# EAGLE design beer (EAGLE 6.2)
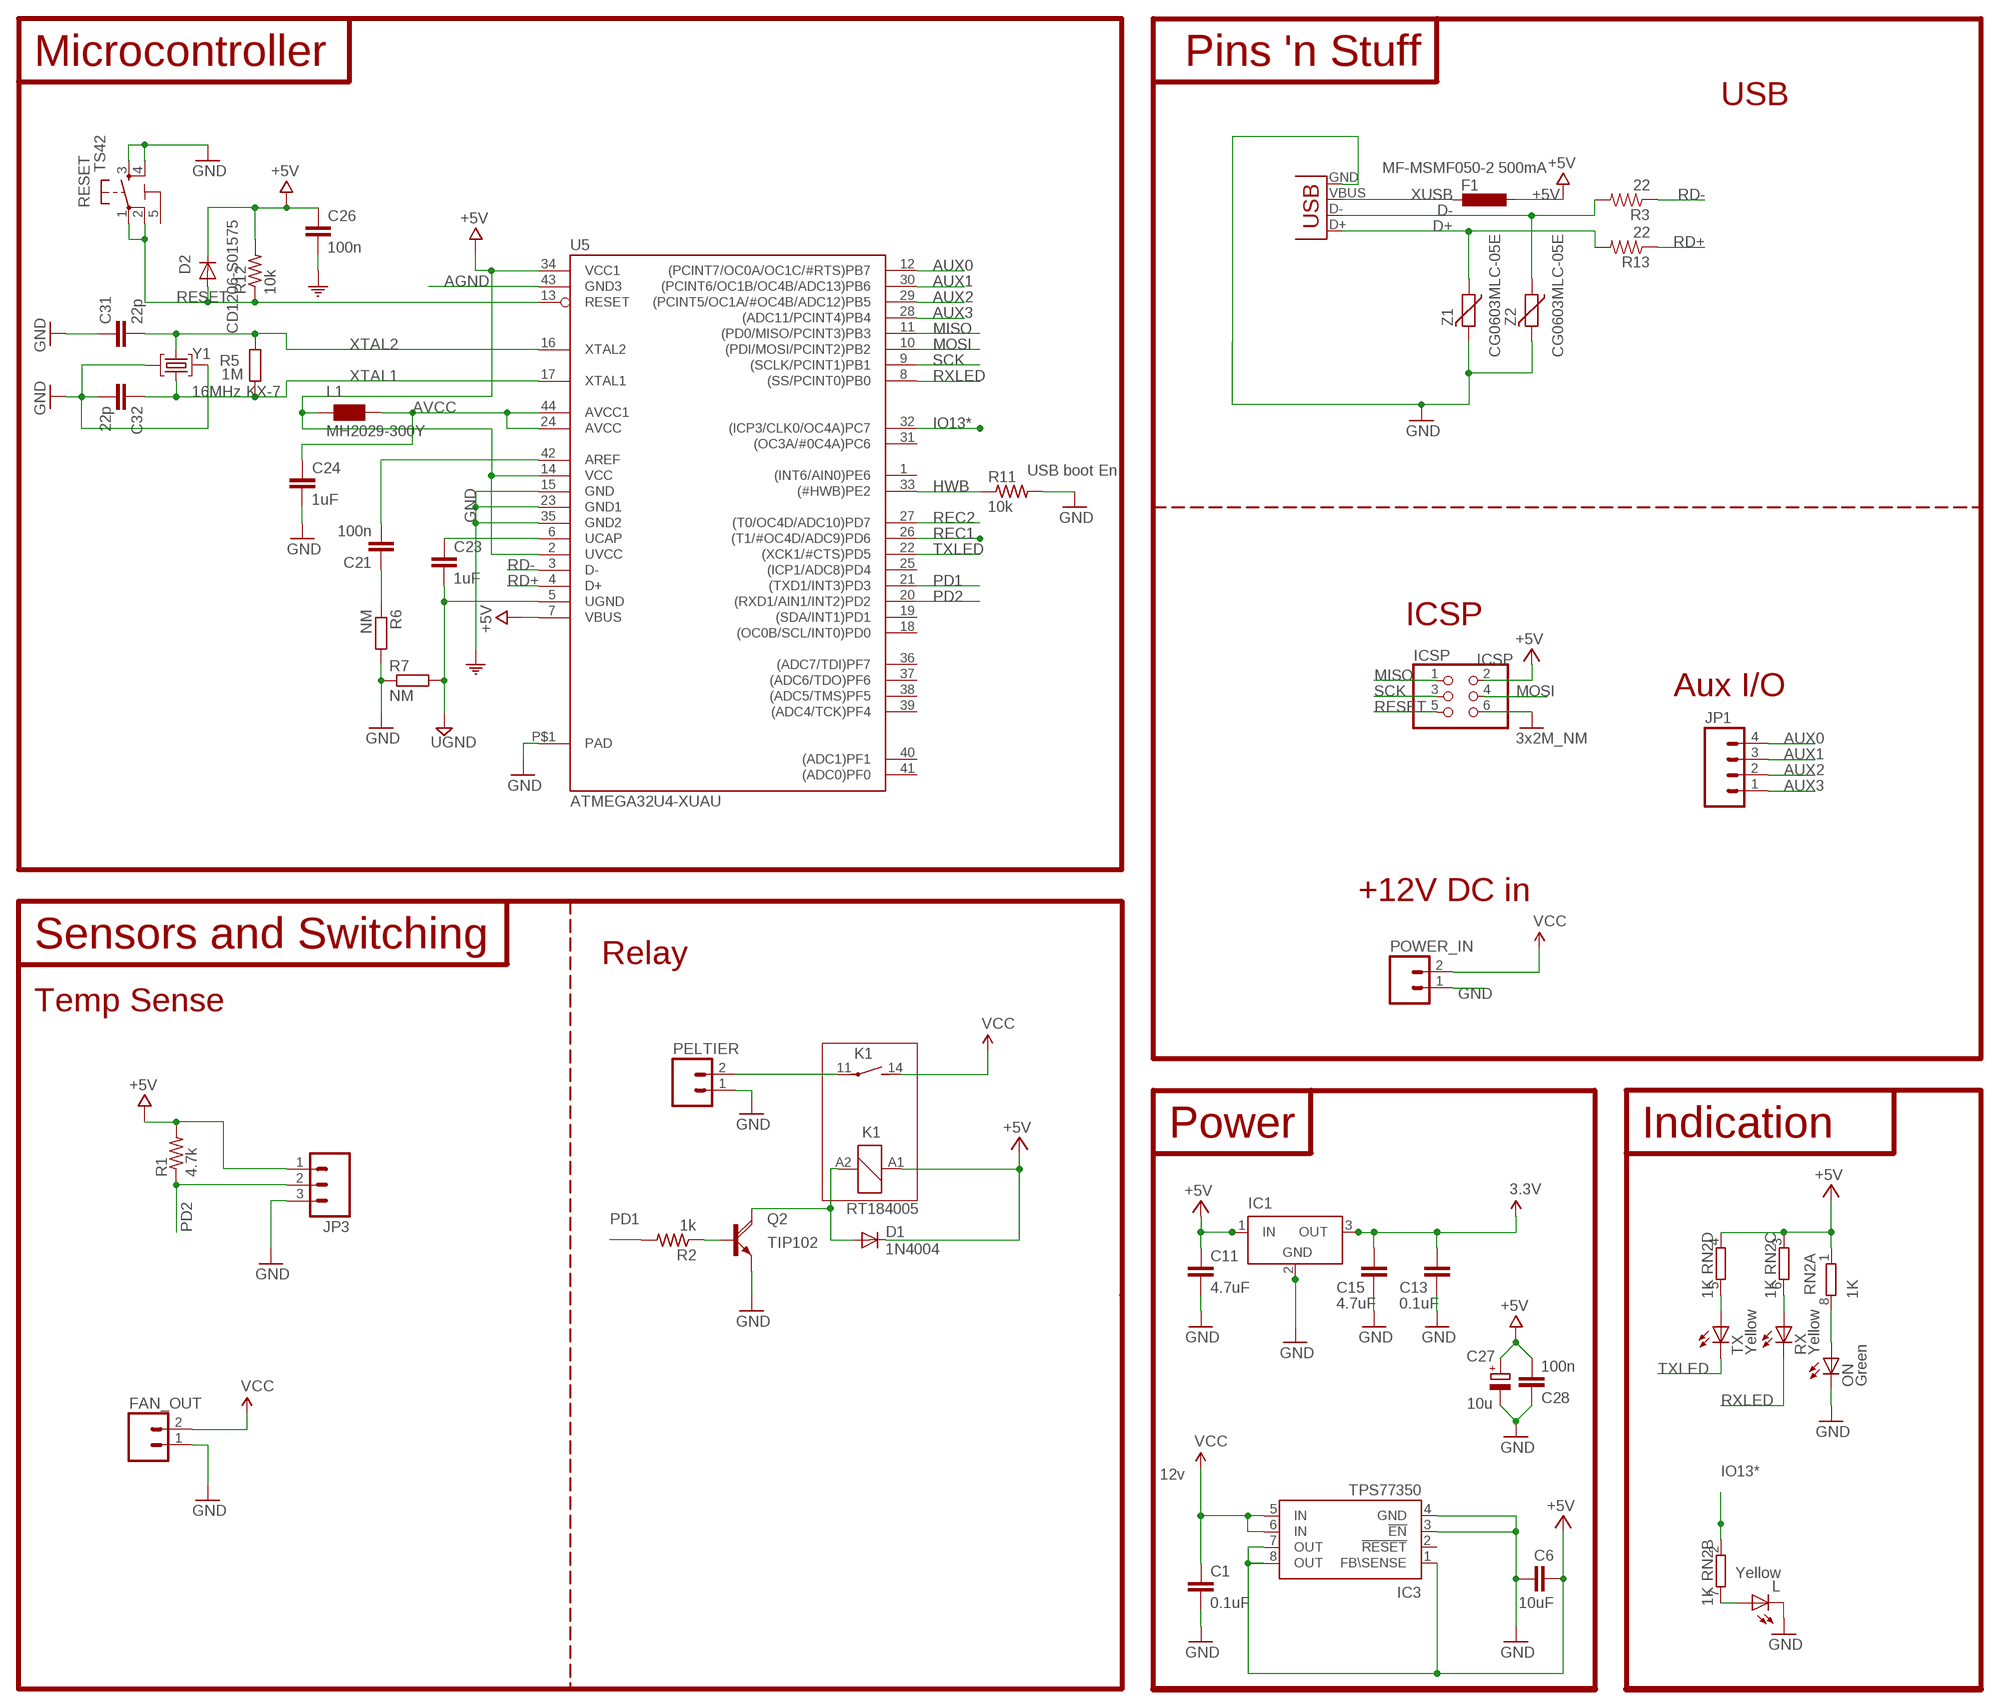
[diagram p0: schematic, sheet 1]

## Parts
C1  0.1uF  CAP0402-CAP  [0402-CAP]
C6  10uF  CAP0402-CAP  [0402-CAP]
C11  4.7uF  CAP0402-CAP  [0402-CAP]
C13  0.1uF  CAP0402-CAP  [0402-CAP]
C15  4.7uF  CAP0402-CAP  [0402-CAP]
C21  100n  C-EUC0603  [C0603-ROUND]
C23  1uF  C-EUC0603  [C0603-ROUND]
C24  1uF  C-EUC0603  [C0603-ROUND]
C26  100n  C-EUC0603  [C0603-ROUND]
C27  10u  CPOL-EUSMCB  [SMC_B]
C28  100n  C-EUC0603  [C0603-ROUND]
C31  22p  C-EUC0603  [C0603-ROUND]
C32  22p  C-EUC0603  [C0603-ROUND]
D1  1N4004  [DO41-10]
D2  CD1206-S01575  DIODE-MINIMELF  [MINIMELF]
F1  MF-MSMF050-2 500mA  L-EUL1812  [L1812]
FAN_OUT  M02PTH  [1X02]
IC1  LT1129CST5  [SOT223]
IC3  TPS77350  [SOP-08]
ICSP  ICSP  PINHD-2X3  [2X03]
JP1  M04PTH  [1X04]
JP3  M03PTH  [1X03]
K1  RT184005  [RT-N/O12A3.5]
L  Yellow  LEDCHIPLED_0805  [CHIPLED_0805]
L1  MH2029-300Y  WE-CBF_0805  [0805]
ON  Green  LEDCHIPLED_0805  [CHIPLED_0805]
PELTIER  M02PTH  [1X02]
POWER_IN  M02PTH  [1X02]
Q2  TIP120  [TO220AH]
R1  4.7k  R-US_R0603  [R0603]
R2  1k  R-US_R0603  [R0603]
R3  22  RESISTOR0603-RES  [0603-RES]
R5  1M  R-EU_R0603  [R0603-ROUND]
R6  NM  R-EU_R0603  [R0603-ROUND]
R7  NM  R-EU_R0603  [R0603-ROUND]
R11  10k  R-US_R0603  [R0603]
R12  10k  R-US_R0603  [R0603]
R13  22  RESISTOR0603-RES  [0603-RES]
RESET  TS42  [TS42]
RN2  1K  4R-NCAY16  [CAY16]
RX  Yellow  LEDCHIPLED_0805  [CHIPLED_0805]
TX  Yellow  LEDCHIPLED_0805  [CHIPLED_0805]
U5  ATMEGA32U4-XUAU  [TQFP44-PAD]
X2  USB-MICROB  [USB-MICROB]
Y1  16MHz KX-7  CRYSTAL-3.2-2.5  [CRYSTAL-3.2-2.5]
Z1  CG0603MLC-05E  VARISTORCN0603  [CT/CN0603]
Z2  CG0603MLC-05E  VARISTORCN0603  [CT/CN0603]

## Nets
3V3: C13.1 C15.1 IC1.3(OUT) ; supply symbol labelled 3.3V
+5V: C11.1 C26.1 C27.+ C28.2 D1.C D2.C F1.1 IC1.1(IN) ICSP.2 JP3.1 K1.A1 L1.1 R1.2 R12.2 RN2.1 RN2.3 RN2.4 U5.2(UVCC) U5.7(VBUS) U5.14(VCC) U5.34(VCC1)
AGND: C21.1 R6.1 U5.43(GND3)
AREF: C21.2 U5.42(AREF)
AUX0: JP1.4 U5.12((PCINT7/OC0A/OC1C/#RTS)PB7)
AUX1: JP1.3 U5.30((PCINT6/OC1B/OC4B/ADC13)PB6)
AUX2: JP1.2 U5.29((PCINT5/OC1A/#OC4B/ADC12)PB5)
AUX3: JP1.1 U5.28((ADC11/PCINT4)PB4)
AVCC: C24.1 L1.2 U5.24(AVCC) U5.44(AVCC1)
D+: R13.2 X2.D+ Z1.1
D-: R3.2 X2.D- Z2.1
GND: C1.2 C6.1 C11.2 C13.2 C15.2 C24.2 C26.2 C27.- C28.1 C31.1 C32.2 FAN_OUT.1 IC1.2(GND) IC3.3(!EN) IC3.4(GND) ICSP.6 JP3.3 L.C ON.C PELTIER.1 POWER_IN.1 Q2.E R6.2 R7.1 R11.2 RESET.3 RESET.4 U5.15(GND) U5.23(GND1) U5.35(GND2) U5.P$1(PAD) X2.GND Y1.2(GND) Y1.4(GND) Z1.2 Z2.2 ; supply symbol labelled 3x2M_NM, COM
HWB: R11.1 U5.33((#HWB)PE2)
IO13*: RN2.2 U5.32((ICP3/CLK0/OC4A)PC7)
MISO: ICSP.1 U5.11((PD0/MISO/PCINT3)PB3)
MOSI: ICSP.4 U5.10((PDI/MOSI/PCINT2)PB2)
N$1: K1.11(2:P) PELTIER.2
N$3: D1.A K1.A2 Q2.C
N$4: RN2.5 TX.A
N$5: C6.2 IC3.1(FB\SENSE) IC3.7(OUT) IC3.8(OUT) ; supply symbol labelled +5V
N$7: Q2.B R2.1
N$8: ON.A RN2.8
N$9: L.A RN2.7
N$10: RN2.6 RX.A
PD1: R2.2 U5.21((TXD1/INT3)PD3)
PD2: JP3.2 R1.1 U5.20((RXD1/AIN1/INT2)PD2)
RD+: R13.1 U5.4(D+)
RD-: R3.1 U5.3(D-)
REC1: U5.26((T1/#OC4D/ADC9)PD6)
REC2: U5.27((T0/OC4D/ADC10)PD7)
RESET: D2.A ICSP.5 R12.1 RESET.1 RESET.2 U5.13(RESET)
RXLED: RX.C U5.8((SS/PCINT0)PB0)
SCK: ICSP.3 U5.9((SCLK/PCINT1)PB1)
TXLED: TX.C U5.22((XCK1/#CTS)PD5)
UCAP: C23.1 U5.6(UCAP)
UGND [gnd]: C23.2 R7.2 U5.5(UGND)
VCC: C1.1 FAN_OUT.2 IC3.5(IN) IC3.6(IN) K1.14(2:S) POWER_IN.2
XTAL1: C32.1 R5.1 U5.17(XTAL1) Y1.1(C1)
XTAL2: C31.2 R5.2 U5.16(XTAL2) Y1.3(C2)
XUSB [usbvcc]: F1.2 X2.VBUS
Unconnected: IC3.2(!RESET) U5.1((INT6/AIN0)PE6) U5.18((OC0B/SCL/INT0)PD0) U5.19((SDA/INT1)PD1) U5.25((ICP1/ADC8)PD4) U5.31((OC3A/#0C4A)PC6) U5.36((ADC7/TDI)PF7) U5.37((ADC6/TDO)PF6) U5.38((ADC5/TMS)PF5) U5.39((ADC4/TCK)PF4) U5.40((ADC1)PF1) U5.41((ADC0)PF0)

## Notes on the sheet
- Microcontroller | Pins 'n Stuff
- USB
- USB boot En
- ICSP
- Aux I/O
- +12V DC in
- Sensors and Switching
- Relay
- Temp Sense
- Power | Indication
- TIP102
- 12v

## Power pins joined to a net without a drawn wire
5-GND: RESET.5(5-GND)
GND: IC1.4(GND)

## Library data of the parts
C1 C6 C11 C13 C15 = SparkFun:CAP: Capacitor Standard 0603 ceramic capacitor, and 0.1" leaded capacitor.
C21 C23 C24 C26 C28 C31 C32 = SmartPrj:C-EU: CAPACITOR, European symbol
C27 = rcl:CPOL-EU: POLARIZED CAPACITOR, European symbol
D1 = diode:1N4004: DIODE general purpose rectifier, 1 A
D2 = diode:DIODE-: DIODE
F1 = rcl:L-EU: INDUCTOR, European symbol
FAN_OUT PELTIER POWER_IN = SparkFun:M02: Header 2 Standard 2-pin 0.1" header. Use with straight break away headers (SKU : PRT-00116), right angle break away headers (PRT-00553), swiss pins (PRT-00743), machine pins (PRT-00117), and female headers (PRT-00115). Molex polarized connector foot print use with SKU : PRT-08233 with associated crimp pins and housings.
IC1 = linear-technology:LT1129CST5: VOLTAGE REGULATOR with shutdown; MPN: LT1129CST-5#PBF; OC_FARNELL: 1663375; OC_NEWARK: 57M2069
IC3 = texas:TPS773*: 250-mA LDO REGULATORS WITH RESET OUTPUT WITH 8-PIN MSOP PACKAGING Source: http://focus.ti.com/lit/ds/symlink/tps77333.pdf; MF: TEXAS INSTRUMENT CONNECTORS; MPN: TPS77350DGK; OC_FARNELL: 1412894; OC_NEWARK: 77C1226
ICSP = SmartPrj:PINHD-2X3: PIN HEADER
JP1 = SparkFun:M04: Header 4 Standard 4-pin 0.1" header. Use with straight break away headers (SKU : PRT-00116), right angle break away headers (PRT-00553), swiss pins (PRT-00743), machine pins (PRT-00117), and female headers (PRT-00115). Molex polarized connector foot print use with SKU : PRT-08231 with associated crimp pins and housings. 1MM SMD Version SKU: PRT-10208
JP3 = SparkFun:M03: Header 3 Standard 3-pin 0.1" header. Use with straight break away headers (SKU : PRT-00116), right angle break away headers (PRT-00553), swiss pins (PRT-00743), machine pins (PRT-00117), and female headers (PRT-00115). Molex polarized connector foot print use with SKU : PRT-08232 with associated crimp pins and housings.
K1 = relay:RT?*: Power PCB Relay SCHRACK 1 pole 12 / 16 A, DC- or AC-coil Source: http://www.schrack.com/.. 5819.pdf; MF: TYCO ELECTRONICS; MPN: RT184005; OC_FARNELL: unknown; OC_NEWARK: 08H3730
L ON RX TX = led:LED: LED OSRAM: - CHIPLED LG R971, LG N971, LY N971, LG Q971, LY Q971, LO R971, LY R971 LH N974, LH R974 LS Q976, LO Q976, LY Q976 LO Q996 - Hyper CHIPLED LW Q18S LB Q993, LB Q99A, LB R99A - SideLED LS A670, LO A670, LY A670, LG A670, LP A670 LB A673, LV A673, LT A673, LW A673 LH A674 LY A675 LS A676, LA A676, LO A676, LY A676, LW A676 LS A679, LY A679, LG A679 - Hyper Micro SIDELED® LS Y876, LA Y876, LO Y876, LY Y876 LT Y87S - SmartLED LW L88C, LW L88S LB L89C, LB L89S, LG L890 LS L89K, LO L89K, LY L89K LS L896, LA L896, LO L896, LY L896 - TOPLED LS T670, LO T670, LY T670, LG T670, LP T670 LSG T670, LSP T670, LSY T670, LOP T670, LYG T670 LG T671, LOG T671, LSG T671 LB T673, LV T673, LT T673, LW T673 LH T674 LS T676, LA T676, LO T676, LY T676, LB T676, LH T676, LSB T676, LW T676 LB T67C, LV T67C, LT T67C, LS T67K, LO T67K, LY T67K, LW E67C LS E67B, LA E67B, LO E67B, LY E67B, LB E67C, LV E67C, LT E67C LW T67C LS T679, LY T679, LG T679 LS T770, LO T770, LY T770, LG T770, LP T770 LB T773, LV T773, LT T773, LW T773 LH T774 LS E675, LA E675, LY E675, LS T675 LS T776, LA T776, LO T776, LY T776, LB T776 LHGB T686 LT T68C, LB T68C - Hyper Mini TOPLED® LB M676 - Mini TOPLED Santana® LG M470 LS M47K, LO M47K, LY M47K Source: http://www.osram.convergy.de LUXEON: - LUMILED® LXK2-PW12-R00, LXK2-PW12-S00, LXK2-PW14-U00, LXK2-PW14-V00 LXK2-PM12-R00, LXK2-PM12-S00, LXK2-PM14-U00 LXK2-PE12-Q00, LXK2-PE12-R00, LXK2-PE12-S00, LXK2-PE14-T00, LXK2-PE14-U00 LXK2-PB12-K00, LXK2-PB12-L00, LXK2-PB12-M00, LXK2-PB14-N00, LXK2-PB14-P00, LXK2-PB14-Q00 LXK2-PR12-L00, LXK2-PR12-M00, LXK2-PR14-Q00, LXK2-PR14-R00 LXK2-PD12-Q00, LXK2-PD12-R00, LXK2-PD12-S00 LXK2-PH12-R00, LXK2-PH12-S00 LXK2-PL12-P00, LXK2-PL12-Q00, LXK2-PL12-R00 Source: www.luxeon.com KINGBRIGHT: KA-3528ASYC Source: www.kingbright.com
L1 = wuerth-elektronik:WE-CBF: SMD EMI Suppression Ferrite Beads - excellent anti-EMI properties - low DCR - impedances till 3000 ohms - rated current up to 6 A
Q2 = transistor-power:TIP120: NPN DARLINGTON TRANSISTOR
R1 R2 R11 R12 = resistor:R-US_: RESISTOR, American symbol
R3 R13 = SparkFun:RESISTOR: Resistor Basic schematic elements and footprints for 0603, 1206, and PTH resistors.
R5-R7 = SmartPrj:R-EU_: RESISTOR, European symbol
RESET = SmartPrj:TS42: TS42 Dongnan Electronics Tact switch VDC 12V - 50mA
RN2 = resistor-dil:4R-N: Array Chip Resistor Source: RS Component / Phycomp
U5 = SmartPrj:ATMEGA32U4-XU
X2 = SparkFun:USB: USB Connectors USB-B-PTH is fully proven SKU : PRT-00139 USB-miniB is fully proven SKU : PRT-00587 USB-A-PCB is untested. USB-A-H is throughly reviewed, but untested. Spark Fun Electronics SKU : PRT-00437 USB-B-SMT is throughly reviewed, but untested. Needs silkscreen touching up. USB-A-S has not been used/tested USB-MB-H has not been used/tested
Y1 = SmartPrj:CRYSTAL-3.2-2.5
Z1 Z2 = varistor:VARISTOR: VARISTOR

## Net classes
0 default: width 0.203 mm, drill 0.406 mm, clearance 0.152 mm
1 power: width 0.203 mm, drill 0.508 mm, clearance 0.152 mm
2 gnd: width 0.254 mm, drill 0.61 mm, clearance 0.254 mm
3 usbvcc: width 0.203 mm, drill 0.508 mm, clearance 0.152 mm
4 aref: width 0.254 mm, drill 0.61 mm, clearance 0.254 mm

## Board
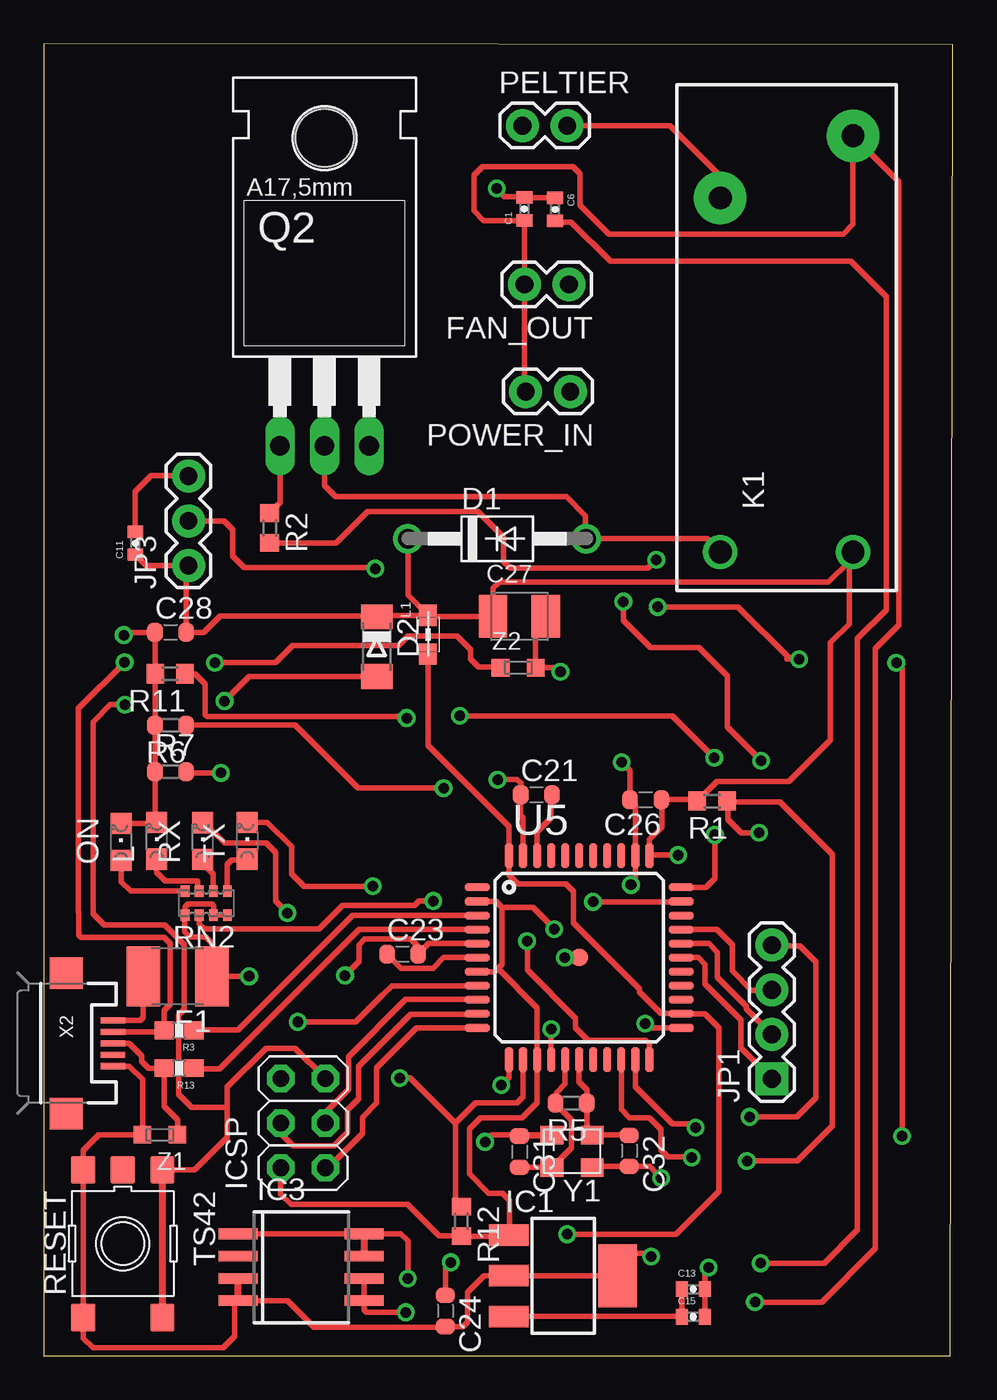
[diagram p1: board, top side]
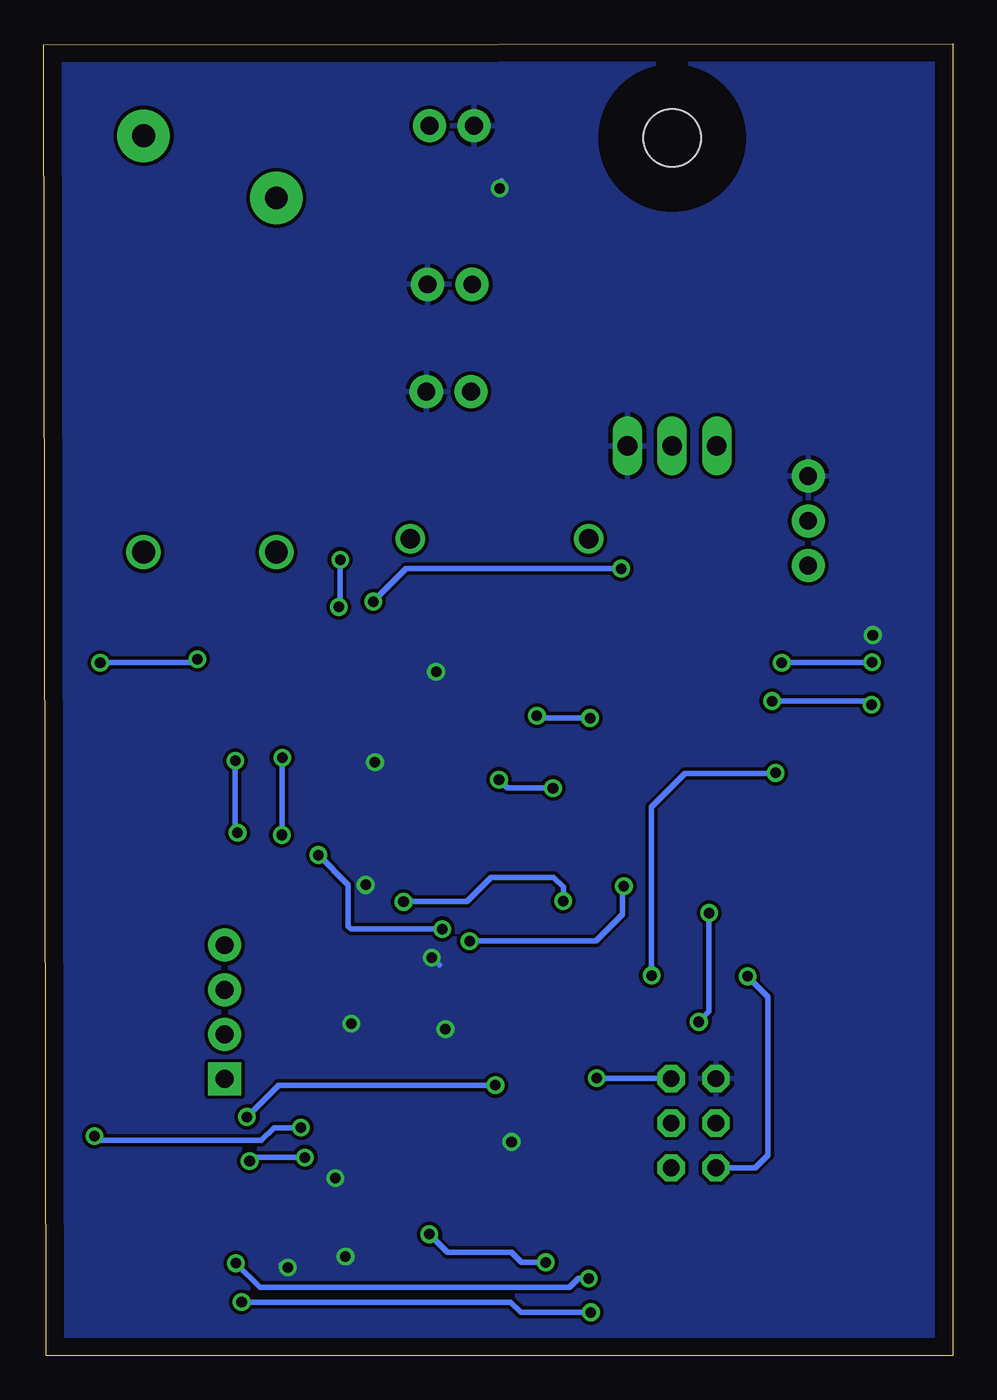
[diagram p2: board, bottom side, seen from below]

Size 51.75 x 74.68 mm. Coordinates in mm from the lower left corner, seen from the top.
Outline: 0,0 51.62,0 51.74,74.62 0,74.68 0,0
Copper layers (1*16): Top 0.035mm / dielectric 1.5mm / Bottom 0.035mm
Design rules: minimum track width 10mil, minimum drill 24mil, track to track 8mil, track to pad 8mil, pad to pad 8mil, via to via 8mil, smd to smd 8mil, copper to edge 40mil, drill to drill 8mil, minimum pad ring 10mil, minimum via ring 8mil, stop-mask expansion 4mil, vias tented up to drill 0mil, thermal gap 10mil

### Footprints (pad centres in the part's own frame; a part is rotated, then mirrored left to right if it is on the bottom)
0402-CAP = smd 0.7 x 0.9: 1 -0.65,0; 2 0.65,0
C0603-ROUND = smd 0.898 x 1.1: 1 -0.889,0; 2 0.889,0
SMC_B = smd 1.6 x 2.4: + -1.5,0; - 1.5,0
DO41-10 = drill 1.118: A 5.08,0; C -5.08,0
MINIMELF = smd 1.4 x 1.8: A 1.7,0; C -1.7,0
L1812 = smd 1.9 x 3.4: 1 -1.95,0; 2 1.95,0
1X02 = drill 1.016 pad 1.88: 1 0,0; 2 2.54,0
SOT223 = smd 1.219 x 2.235: 1 -2.311,-3.099; 2 0,-3.099; 3 2.311,-3.099 | smd 3.6 x 2.2: 4 0,3.099
SOP-08 = smd 0.6 x 2.2: 1 -1.905,-3.6; 2 -0.635,-3.6; 3 0.635,-3.6; 4 1.905,-3.6; 5 1.905,3.575; 6 0.635,3.575; 7 -0.635,3.575; 8 -1.905,3.575
2X03 = drill 0.95 pad 1.55 octagon: 1 -2.54,-1.27; 2 -2.54,1.27; 3 0,-1.27; 4 0,1.27; 5 2.54,-1.27; 6 2.54,1.27
1X04 = drill 1.016 pad 1.88 square: 1 0,0 | drill 1.016 pad 1.88: 2 2.54,0; 3 5.08,0; 4 7.62,0
1X03 = drill 1.016 pad 1.88: 1 0,0; 2 2.54,0; 3 5.08,0
RT-N/O12A3.5 = drill 1.3 pad 3: 11 7.56,3.78; 14 11.1,-3.78 | drill 1.3: A1 -12.6,-3.78; A2 -12.6,3.78
CHIPLED_0805 = smd 1.2 x 1.2: A 0,-1.05; C 0,1.05
0805 = smd 1.2 x 1: 1 -1.1,0; 2 1.1,0
TO220AH = drill 1.118 long: B -2.54,-6.35; C 0,-6.35; E 2.54,-6.35 | hole 3.302: 0,11.176
R0603 = smd 1 x 1.1: 1 -0.85,0; 2 0.85,0
0603-RES = smd 1.1 x 1: 1 -0.85,0; 2 0.85,0
R0603-ROUND = smd 0.898 x 1.1: 1 -0.889,0; 2 0.889,0
TS42 = smd 1.6 x 1.4: 1 -4.2,2.25; 2 4.2,2.25; 3 -4.2,-2.25; 4 4.2,-2.25; 5 -4.2,0
CAY16 = smd 0.5 x 0.65: 1 -1.2,-0.675; 2 -0.4,-0.675; 3 0.4,-0.675; 4 1.2,-0.675; 5 1.2,0.675; 6 0.4,0.675; 7 -0.4,0.675; 8 -1.2,0.675
TQFP44-PAD = smd 1.4 x 0.45: 1 -5.8,4; 2 -5.8,3.2; 3 -5.8,2.4; 4 -5.8,1.6; 5 -5.8,0.8; 6 -5.8,0; 7 -5.8,-0.8; 8 -5.8,-1.6; 9 -5.8,-2.4; 10 -5.8,-3.2; 11 -5.8,-4; 23 5.8,-4; 24 5.8,-3.2; 25 5.8,-2.4; 26 5.8,-1.6; 27 5.8,-0.8; 28 5.8,0; 29 5.8,0.8; 30 5.8,1.6; 31 5.8,2.4; 32 5.8,3.2; 33 5.8,4 | smd 0.45 x 1.4: 12 -4,-5.8; 13 -3.2,-5.8; 14 -2.4,-5.8; 15 -1.6,-5.8; 16 -0.8,-5.8; 17 0,-5.8; 18 0.8,-5.8; 19 1.6,-5.8; 20 2.4,-5.8; 21 3.2,-5.8; 22 4,-5.8; 34 4,5.8; 35 3.2,5.8; 36 2.4,5.8; 37 1.6,5.8; 38 0.8,5.8; 39 0,5.8; 40 -0.8,5.8; 41 -1.6,5.8; 42 -2.4,5.8; 43 -3.2,5.8; 44 -4,5.8 | smd 1 x 1: P$1 0,0
USB-MICROB = smd 0.35 x 1.4: D+ 0,2.65; D- -0.65,2.65; GND 1.3,2.65; ID 0.65,2.65; VBUS -1.3,2.65 | smd 1.8 x 1.9: MT1 -4,0; MT2 4,0
CRYSTAL-3.2-2.5 = smd 1.3 x 1.05: 1 -1.15,-0.925; 2 1.15,-0.925; 3 1.15,0.925; 4 -1.15,0.925
CT/CN0603 = smd 1 x 1: 1 -1,0; 2 1,0

### Placement (x,y rotation side)
C1  27.36,65.28 90 top
C6  29.11,65.25 270 top
C11  5.21,46.25 90 top
C13  36.98,3.78 0 top
C15  36.98,2.21 0 top
C21  28.04,31.93 0 top
C23  20.42,22.86 0 top
C24  22.86,2.54 270 top
C26  34.26,31.65 180 top
C27  27.08,42.09 0 top
C28  7.21,41.17 0 top
C31  27.08,11.61 270 top
C32  33.32,11.66 270 top
D1  25.81,46.51 0 top
D2  18.95,40.36 270 top
F1  7.62,21.59 180 top
FAN_OUT  29.9,60.99 180 top
IC1  29.57,4.55 270 top
IC3  14.66,5.03 270 top
ICSP  14.76,13.23 90 top
JP1  41.45,15.75 90 top
JP3  8.23,44.98 90 top
K1  42.29,58.34 90 top
L  6.43,29.31 0 top
L1  21.87,41.05 270 top
ON  4.39,29.24 0 top
PELTIER  27.25,70.03 0 top
POWER_IN  29.97,54.89 180 top
Q2  15.98,58.14 0 top
R1  38.05,31.57 180 top
R2  12.85,47.12 270 top
R3  7.7,18.52 180 top
R5  30.02,14.38 180 top
R6  7.21,35.89 180 top
R7  7.21,33.25 0 top
R11  7.19,38.81 180 top
R12  23.77,7.65 270 top
R13  7.7,16.36 180 top
RESET  4.5,6.38 270 top
RN2  9.25,25.76 0 top
RX  9.04,29.29 0 top
TX  11.58,29.31 0 top
U5  30.48,22.66 0 top
X2  1.27,17.78 270 top
Y1  30.07,11.63 180 top
Z1  6.6,12.57 180 top
Z2  27,39.17 0 top

### Tracks (layer width: path | path; a pad name or v marks a point on that pad's centre or on a via)
3V3
  Top 0.305: IC1.3 36.31,2.23 C15.1 C13.1
+5V  (via drill 0.6)
  Top 0.305: U5.2 25.73,25.86 26.09,25.5 | 26.09,25.5 26.09,22.28 25.84,22.04 | 25.84,22.04 25.65,21.84 24.69,21.84 U5.7 | ICSP.2 13.49,9.2 14.07,8.61 20.7,8.61 22.5,6.81 R12.2 26.4,6.79 IC1.1 26.52,6.91 26.52,8.84 26.11,9.25 25.32,9.25 24.23,10.34 24.23,12.9 24.87,13.54 27.23,13.54 28.08,14.39 U5.14 28.08,19.8 25.84,22.04 | 37.12,31.65 C26.1 35.18,31.62 35.18,30.07 34.48,29.38 U5.34 34.52,28.5 v36.12,28.5 | 37.12,31.65 R1.2 | 37.12,31.65 37.12,31.69 37.26,31.83 | L1.1 21.93,42.09 C27.+ 25.58,43.69 25.93,44.04 44.68,44.04 45.85,45.21 | L1.1 19.56,42.15 | 19.56,42.15 19.03,42.15 D2.C | D1.C 20.73,43.29 L1.1 | C11.1 5.83,44.98 JP3.1 8.1,44.86 C28.2 9.09,41.17 10.03,42.11 19.52,42.11 19.56,42.15 | RN2.4 RN2.3 9.68,25.11 9.68,25.6 9.58,25.7 8.2,25.7 8.05,25.55 RN2.1 8.03,25.06 8.03,24.13 8.33,23.82 9.22,23.82 9.57,23.48 F1.1 v11.68,21.59 | K1.A1 46.07,45.44 45.85,45.21 | 37.24,31.61 R1.2 | 45.85,45.21 45.85,41.66 44.78,40.59 44.78,35.05 42.42,32.69 38.32,32.69 R1.2 | 26.09,25.5 27.84,25.5 v29.06,24.28
  Bottom 0.305: ICSP.2 11.23,10.69 10.52,11.4 10.52,20.42 v11.68,21.59 | v29.06,24.28 34.27,24.28 34.42,24.43 34.42,26.8 v36.12,28.5
AGND  (via drill 0.6)
  Top 0.305: U5.43 27.28,30.61 27.13,30.76 27.13,31.9 C21.1 27.15,32.59 26.95,32.79 v25.83,32.79 | R6.1 14.3,35.89 17.88,32.31 v22.76,32.31
  Bottom 0.305: v22.76,32.31 25.35,32.31 v25.83,32.79
AREF
  Top 0.305: U5.42 28.08,29.81 28.88,30.61 28.88,31.88 C21.2
AUX0  (via drill 0.6)
  Top 0.305: U5.12 26.48,15.84 v26.04,15.39 | v40.18,13.59 42.88,13.59 43.97,14.68 43.97,22.4 43.05,23.32 41.5,23.32 JP1.4
  Bottom 0.305: v40.18,13.59 38.38,15.39 v26.04,15.39
AUX1
  Top 0.305: U5.30 38.33,24.26 39.19,23.39 39.19,21.89 40.28,20.8 41.43,20.8 JP1.3
AUX2
  Top 0.305: U5.29 37.86,23.46 38.35,22.96 38.35,21.54 40.01,19.89 40.01,19.74 JP1.2
AUX3
  Top 0.305: U5.28 37.26,22.66 37.64,22.28 37.64,21.16 39.67,19.13 39.67,17.53 JP1.1
AVCC  (via drill 0.6)
  Top 0.305: C24.1 22.86,5 v23.16,5.31 | v29.79,6.91 35.99,6.91 38.43,9.35 38.43,18.67 37.64,19.46 U5.24 36.26,19.48 35.13,19.48 33.91,20.7 33.91,20.88 30.15,24.64 30.15,26.42 29.72,26.85 27,26.85 26.49,27.36 26.49,28.47 | L1.2 21.87,34.75 26.49,30.12 26.49,28.47 | 26.49,28.47 U5.44
  Bottom 0.305: v23.16,5.31 24.56,5.31 25.12,5.87 28.75,5.87 v29.79,6.91
D+
  Top 0.305: X2.D+ 4.85,17.78 5.56,17.07 5.56,16.76 5.97,16.36 R13.2 6.85,14.19 7.62,13.41 7.62,12.59 Z1.1
D-  (via drill 0.6)
  Top 0.305: X2.D- 6.76,18.43 R3.2 6.85,19.29 6.85,19.65 7.19,19.99 7.19,23.47 6.86,23.8 2.13,23.8 1.98,23.95 1.98,25.25 1.96,25.27 1.96,36.83 v4.6,39.47 | v9.73,39.45 13.18,39.45 14.17,40.44 20.19,40.44 20.73,40.97 23.52,40.97 24.28,40.21 24.28,39.65 24.74,39.19 25.98,39.19 Z2.1
  Bottom 0.305: v4.6,39.47 9.7,39.47 v9.73,39.45
GND  (via drill 0.6)
  Top 0.305: X2.GND 4.8,16.48 4.86,16.48 5.61,15.72 5.61,12.58 Z1.2 4.55,12.57 3.12,12.57 2.25,11.7 RESET.3 RESET.4 2.25,0.98 2.79,0.43 10.21,0.43 10.87,1.09 10.87,2.94 IC3.4 13.87,3.12 15.39,1.6 22.81,1.6 C24.2 23.88,1.65 24.13,1.91 24.13,3.61 25.07,4.55 IC1.2 IC1.4 | IC1.4 33.12,4.55 33.22,4.65 | 33.22,4.65 32.77,4.65 IC1.4 | Y1.4 31.29,10.77 C32.2 34.49,10.77 34.87,10.39 v35.15,10.11 | C31.1 28.86,12.5 Y1.2 | Y1.2 29.37,12.56 | 33.22,4.65 33.22,5.56 32.97,5.82 34.39,5.82 v34.57,5.64 | Y1.2 25.51,12.56 v25.12,12.17 | U5.P$1 v29.67,22.66 | U5.23 34.48,18.66 v34.24,18.9 | v33.43,26.8 33.68,27.05 U5.35 33.68,31.34 C26.2 33.38,33.3 v32.89,33.78 | U5.15 v28.88,18.59 | v28.88,18.59 | C27.- 28,41.51 Z2.2 29.18,39.17 v29.41,38.94 | C15.2 C13.2 37.63,4.79 v37.85,5 | C11.2 5.21,49.2 6.1,50.09 8.2,50.09 JP3.3 | 6.33,38.83 C28.1 4.67,41.17 4.55,41.05 v4.55,41.02 | 6.33,38.83 R11.2 | 6.33,38.83 R6.2 R7.1 6.33,30.46 L.C 6.35,30.29 ON.C | C1.2 27.45,65.93 27.51,65.99 27.33,65.99 | 27.33,65.99 27.25,65.91 29.1,65.91 C6.1 | 27.33,65.99 26.24,65.99 v25.78,66.45
  Top 0.406: IC3.4 IC3.3
  Bottom 0.305: v35.15,10.11 35.18,10.11 35.28,10.01 | 35.28,10.01 35.31,9.98 35.28,10.01 | 35.28,10.01 35.18,10.01 35.1,10.08 | v34.57,5.64 34.57,5.59 34.59,5.56 34.59,5.61 34.65,5.66 34.54,5.56 | v25.12,12.17 25.12,12.04 25.09,12.01 | v34.24,18.9 34.16,18.9 34.14,18.92 | v33.43,26.8 33.38,26.8 33.33,26.75 | v28.88,18.59 28.88,18.69 | v29.67,22.66 29.62,22.66 29.21,22.25 | v32.89,33.78 32.87,33.78 32.82,33.83 | v29.41,38.94 29.46,38.94 29.49,38.91 | v37.85,5 38.1,5 38.25,5.16 | v4.55,41.02 4.52,41.02 4.5,41.05 | v25.78,66.45 25.78,66.78 25.68,66.88
  pour Bottom: 0,0 51.54,0 51.44,74.68 0,74.63
HWB  (via drill 0.6)
  Top 0.305: R11.1 8.61,38.81 9.2,38.23 9.2,36.47 9.3,36.37 20.57,36.37 v20.65,36.3 | v23.67,36.42 35.79,36.42 v38.18,34.04 | v38.2,29.64 38.2,27.15 37.69,26.64 36.29,26.64 U5.33
  Bottom 0.305: v20.65,36.3 23.55,36.3 v23.67,36.42 | v38.18,34.04 38.18,29.67 v38.2,29.64
IO13*  (via drill 0.6)
  Top 0.305: RN2.2 8.85,24.58 9.14,24.28 15.67,24.28 17.02,25.63 21.11,25.63 21.36,25.88 v22.17,25.88 | U5.32 | U5.32 | v31.27,25.83 36.26,25.83 U5.32
  Bottom 0.305: 27.64,25.88 27.66,25.86 | v22.17,25.88 22.17,26.67 22.73,27.23 26.29,27.23 27.66,25.86 | 27.66,25.86 31.24,25.86 v31.27,25.83
MISO
  Top 0.305: ICSP.1 16.18,10.69 17.63,12.14 18.14,12.65 18.14,13.56 18.95,14.38 18.95,16.38 21.21,18.64 24.67,18.64 U5.11
MOSI
  Top 0.305: U5.10 24.65,19.43 20.88,19.43 17.91,16.46 17.91,14.61 17.3,13.99 17.3,12.7 16.54,11.94 14.2,11.94 13.49,12.65 ICSP.4
N$1
  Top 0.305: PELTIER.2 35.64,70.03 38.71,66.95 38.71,66.1 K1.11
N$3
  Top 0.305: K1.A2 37.75,46.51 D1.A 30.84,46.56 30.84,47.8 29.74,48.9 16.61,48.9 15.98,49.53 Q2.C
N$4
  Top 0.305: RN2.5 10.45,27.97 10.69,28.22 11.54,28.22 TX.A
N$5  (via drill 0.6)
  Top 0.305: IC3.1 IC3.8 20.32,6.93 20.73,6.53 v20.73,4.39 | v40.82,5.26 44.42,5.26 46.33,7.16 46.33,40.82 47.95,42.44 47.95,60.3 45.95,62.31 32.26,62.31 30.02,64.54 29.17,64.54 C6.2
  Top 0.406: IC3.8 IC3.7
  Bottom 0.305: v20.73,4.39 21.31,4.39 21.82,3.89 39.45,3.89 v40.82,5.26
N$7
  Top 0.305: Q2.B 13.44,48.55 R2.1
N$8
  Top 0.305: 8.01,26.47 RN2.8 8.04,26.44 4.93,26.44 4.39,26.98 ON.A
N$9
  Top 0.305: L.A 6.43,27.51 6.91,27.03 8.74,27.03 8.76,27 8.76,26.51 RN2.7
N$10
  Top 0.305: RX.A 9.04,28.02 9.63,27.43 9.63,26.45 RN2.6
PD1  (via drill 0.6)
  Top 0.305: U5.21 33.68,15.29 35.79,13.18 36.91,13.18 v37.11,12.98 | v48.87,12.5 48.87,39.12 v48.54,39.45 | v43,39.65 42.49,39.65 | 42.49,39.65 42.32,39.65 | R2.2 16.65,46.27 18.44,48.06 24.71,48.06 26.16,46.61 26.16,45.21 26.54,44.83 34.39,44.83 v34.87,45.31 | v34.95,42.62 39.52,42.62 42.49,39.65
  Bottom 0.305: v37.11,12.98 38.63,12.98 39.37,12.24 48.62,12.24 v48.87,12.5 | v48.54,39.45 43.2,39.45 v43,39.65 | v34.87,45.31 34.87,42.7 v34.95,42.62
PD2  (via drill 0.6)
  Top 0.305: U5.20 32.88,14.01 33.35,13.54 34.47,13.54 35.13,12.88 35.13,11.71 35.53,11.3 36.85,11.3 v36.88,11.28 | v40.03,11.07 42.9,11.07 44.91,13.08 44.91,28.52 41.91,31.52 38.95,31.52 R1.1 38.94,31.53 38.94,30.53 39.7,29.77 v40.72,29.77 | JP3.2 10.26,47.52 10.74,47.04 10.74,45.52 11.4,44.86 18.82,44.86 v18.87,44.81 | v32.99,42.93 32.99,41.86 34.54,40.31 37.29,40.31 38.91,38.68 38.91,35.79 v40.84,33.86
  Bottom 0.305: v36.88,11.28 39.83,11.28 v40.03,11.07 | v18.87,44.81 31.11,44.81 v32.99,42.93 | v40.84,33.86 40.84,29.9 v40.72,29.77
RD+
  Top 0.305: U5.4 17.93,24.26 10.01,16.33 8.57,16.33 R13.1
RD-
  Top 0.305: U5.3 17.56,25.06 11.05,18.54 8.57,18.54 R3.1
RESET  (via drill 0.6)
  Top 0.305: RESET.1 7.88,10.57 8.59,10.57 10.44,12.42 10.44,14.1 | 23.75,8.52 R12.1 23.44,8.83 23.44,13.21 | 10.44,14.1 10.44,15.29 12.65,17.5 14.3,17.5 ICSP.5 | U5.13 27.28,14.73 26.95,14.4 24.59,14.4 23.44,13.26 23.44,13.21 | v20.27,15.8 20.85,15.8 23.44,13.21 | D2.A 11.69,38.66 v10.29,37.26 | v4.62,37.06 3.79,37.06 2.79,36.07 2.79,26.24 2.79,25.15 3.43,24.51 6.88,24.51 7.98,23.42 7.98,19.71 7.67,19.41 7.67,15.82 7.67,14.86 8.41,14.12 10.41,14.12 10.44,14.1
  Top 0.406: RESET.1 RESET.2
  Bottom 0.305: ICSP.5 20.24,15.77 v20.27,15.8 | v10.29,37.26 4.83,37.26 v4.62,37.06
RXLED  (via drill 0.6)
  Top 0.305: RX.C 9.13,30.34 10.29,29.18 12.65,29.18 13.18,28.65 13.18,25.88 v13.87,25.2 | v14.45,19 17.75,19 19.28,20.52 19.81,21.06 U5.8
  Bottom 0.305: v13.87,25.2 13.87,19.58 v14.45,19
SCK
  Top 0.305: ICSP.3 16.03,13.84 17.35,15.16 17.35,17.02 20.6,20.27 24.67,20.27 U5.9
TXLED  (via drill 0.6)
  Top 0.305: TX.C 12.72,30.36 14.1,28.98 14.1,27.43 14.81,26.72 v18.72,26.72 | U5.22 34.48,17.77 34.29,17.96 30.99,17.96 30.28,18.67 30.28,19.2 27.53,21.95 27.53,23.57 v27.51,23.6
  Bottom 0.305: v27.51,23.6 20.32,23.6 18.8,25.12 18.8,26.64 v18.72,26.72
UCAP
  Top 0.305: U5.6 23.01,22.66 22.76,22.66 22.15,22.05 20.34,22.05 C23.1
UGND  (via drill 0.6)
  Top 0.305: U5.5 21.91,23.46 C23.2 21.31,23.29 20.88,23.72 18.26,23.72 17.93,23.39 17.93,22.43 v17.14,21.64 | v10.08,33.17 8.18,33.17 R7.2
  Bottom 0.305: v17.14,21.64 17.14,31.24 15.24,33.15 10.11,33.15 v10.08,33.17
VCC  (via drill 0.6)
  Top 0.305: IC3.5 IC3.6 18.23,2.75 18.23,2.6 18.36,2.46 v20.6,2.46 | POWER_IN.2 27.36,54.97 FAN_OUT.2 C1.1 27.34,64.62 25.04,64.62 24.49,65.18 24.49,67.21 24.97,67.69 30.12,67.69 30.53,67.28 30.53,65.51 32.18,63.86 45.52,63.86 46.07,64.41 46.07,64.74 K1.14 48.69,66.82 48.69,41.6 47.35,40.26 47.35,6.1 44.3,3.05 v40.49,3.05
  Bottom 0.305: v40.49,3.05 25.17,3.05 24.59,2.46 v20.6,2.46
XTAL1
  Top 0.305: U5.17 30.48,15.57 30.91,15.14 R5.1 30.91,12.87 Y1.1 C32.1
XTAL2
  Top 0.305: U5.16 29.68,15.46 29.18,14.96 29.18,14.43 R5.2 29.13,14.33 30.05,13.41 30.05,11.83 Y1.3 C31.2
XUSB
  Top 0.305: X2.VBUS 5.49,19.08 5.66,19.25 5.66,20.98 5.74,21.06 5.74,21.52 F1.2